# EAGLE design Pulsar Buddy (EAGLE 9.5.2)
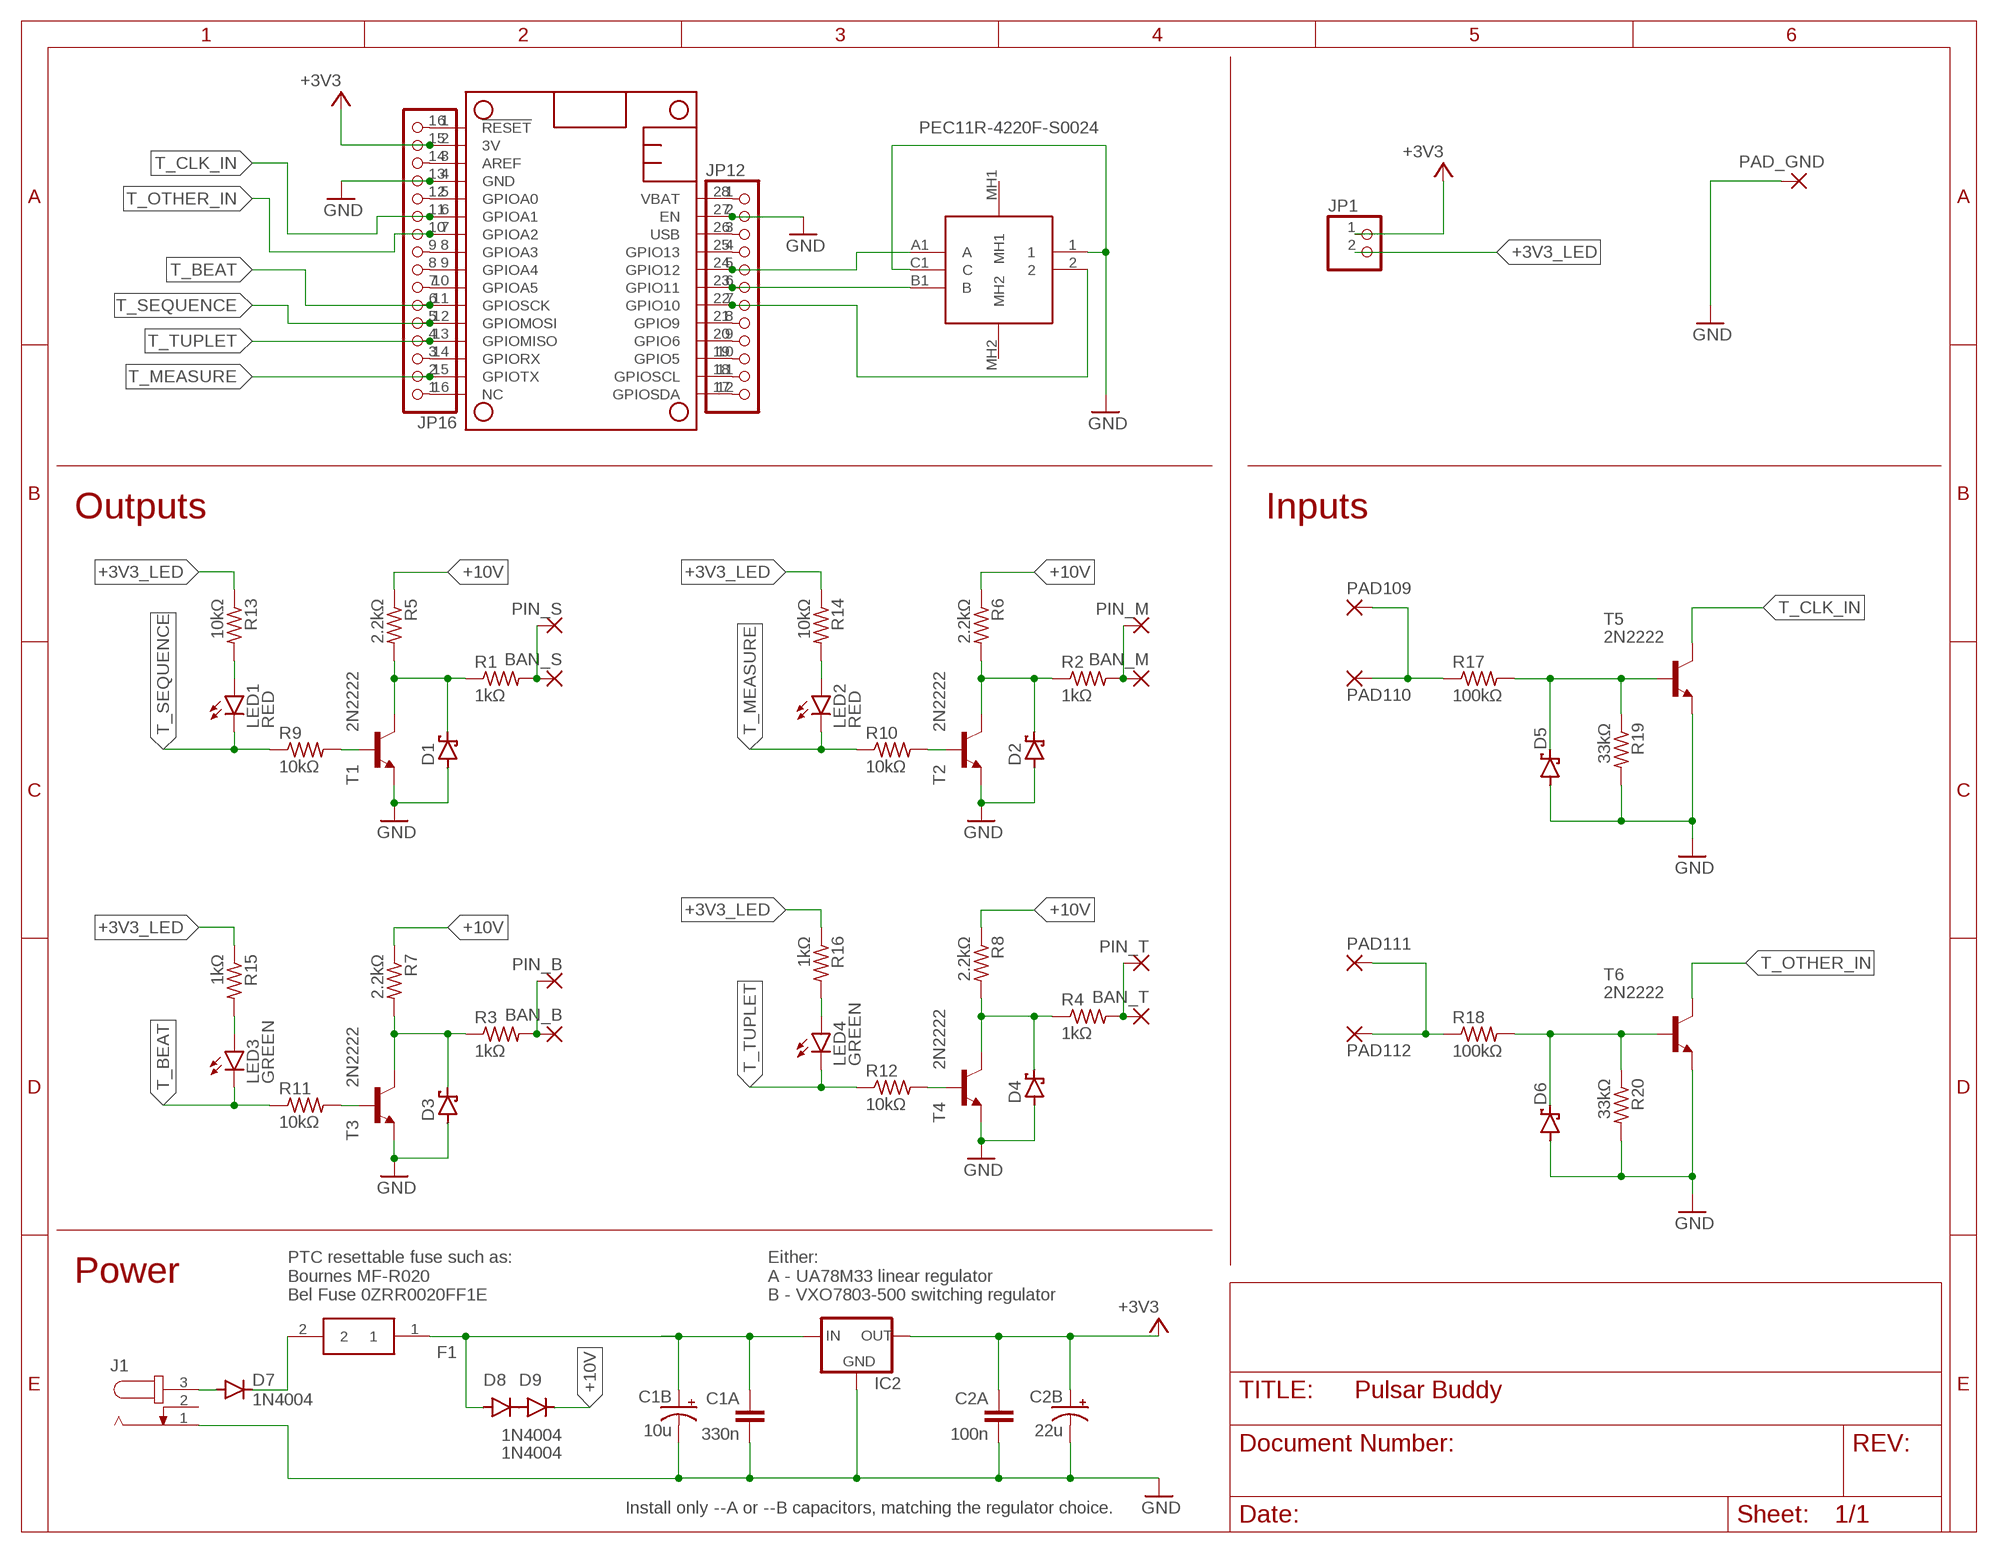
[diagram p0: schematic, sheet 1]

## Parts
BAN_B  WIREPADBANANA  [BANANA]
BAN_M  WIREPADBANANA  [BANANA]
BAN_S  WIREPADBANANA  [BANANA]
BAN_T  WIREPADBANANA  [BANANA]
C1A  330n  C-EU025-024X044  [C025-024X044]
C1B  10u  CPOL-USE5-5  [E5-5]
C2A  100n  C-EU025-024X044  [C025-024X044]
C2B  22u  CPOL-USE5-5  [E5-5]
D1  SCHOTTKY-DIODEDO35-7  [DO35-7]
D2  SCHOTTKY-DIODEDO35-7  [DO35-7]
D3  SCHOTTKY-DIODEDO35-7  [DO35-7]
D4  SCHOTTKY-DIODEDO35-7  [DO35-7]
D5  SCHOTTKY-DIODEDO35-7  [DO35-7]
D6  SCHOTTKY-DIODEDO35-7  [DO35-7]
D7  1N4004  [DO41-10]
D8  1N4004  [DO41-10]
D9  1N4004  [DO41-10]
F1  0ZRR0025FF1E  [0ZRR0025FF1E]
IC2  UA78M33CKCSTO-220  [TO220H]
J1  JACK-PLUG0  [SPC4077]
JP1  PINHD-1X2  [1X02]
JP12  HEADER-1X12  [1X12_ROUND]
JP16  HEADER-1X16ROUND  [1X16_ROUND]
LED1  RED  LED5MM  [LED5MM]
LED2  RED  LED5MM  [LED5MM]
LED3  GREEN  LED5MM  [LED5MM]
LED4  GREEN  LED5MM  [LED5MM]
MS101  FEATHERWING_NODIM  [FEATHERWING_DIM]
PAD109  WIREPAD  [M3]
PAD110  WIREPADBANANA  [BANANA]
PAD111  WIREPAD  [M3]
PAD112  WIREPADBANANA  [BANANA]
PAD_GND  WIREPADBANANA-GND  [BANANA-GND]
PIN_B  WIREPAD  [M3]
PIN_M  WIREPAD  [M3]
PIN_S  WIREPAD  [M3]
PIN_T  WIREPAD  [M3]
R1  1kΩ  R-US_0204/7  [0204/7]
R2  1kΩ  R-US_0204/7  [0204/7]
R3  1kΩ  R-US_0204/7  [0204/7]
R4  1kΩ  R-US_0204/7  [0204/7]
R5  2.2kΩ  R-US_0204/7  [0204/7]
R6  2.2kΩ  R-US_0204/7  [0204/7]
R7  2.2kΩ  R-US_0204/7  [0204/7]
R8  2.2kΩ  R-US_0204/7  [0204/7]
R9  10kΩ  R-US_0204/7  [0204/7]
R10  10kΩ  R-US_0204/7  [0204/7]
R11  10kΩ  R-US_0204/7  [0204/7]
R12  10kΩ  R-US_0204/7  [0204/7]
R13  10kΩ  R-US_0204/7  [0204/7]
R14  10kΩ  R-US_0204/7  [0204/7]
R15  1kΩ  R-US_0204/7  [0204/7]
R16  1kΩ  R-US_0204/7  [0204/7]
R17  100kΩ  R-US_0204/7  [0204/7]
R18  100kΩ  R-US_0204/7  [0204/7]
R19  33kΩ  R-US_0204/7  [0204/7]
R20  33kΩ  R-US_0204/7  [0204/7]
SW1  PEC11R-4220F-S0024  [PEC11R4220FS0024]
T1  2N2222  [TO92-EBC-OVAL]
T2  2N2222  [TO92-EBC-OVAL]
T3  2N2222  [TO92-EBC-OVAL]
T4  2N2222  [TO92-EBC-OVAL]
T5  2N2222  [TO92-EBC-OVAL]
T6  2N2222  [TO92-EBC-OVAL]

## Nets
+3V3: C2A.1 C2B.+ IC2.3(OUT) JP1.1 JP16.15 MS101.2(3V)
+3V3_LED: JP1.2 R13.1 R14.1 R15.1 R16.1
+5V_CPU: JP12.3 MS101.26(USB)
+10V: D9.C R5.1 R6.1 R7.1 R8.1
+12V: C1A.1 C1B.+ D8.A F1.1 IC2.1(IN)
GND: C1A.2 C1B.- C2A.2 C2B.- D1.A D2.A D3.A D4.A D5.A D6.A IC2.2(GND) J1.1 JP12.2 JP16.13 MS101.4(GND) MS101.27(EN) PAD_GND.C(P) R19.2 R20.2 SW1.1 SW1.C1(C) T1.E T2.E T3.E T4.E T5.E T6.E
N$1: JP12.5 MS101.24(GPIO12) SW1.A1(A)
N$2: JP12.7 MS101.22(GPIO10) SW1.2
N$3: JP12.6 MS101.23(GPIO11) SW1.B1(B)
N$4: D7.C F1.2
N$5: D7.A J1.3
N$6: LED1.A R13.2
N$7: LED2.A R14.2
N$8: R9.2 T1.B
N$9: D1.C R1.1 R5.2 T1.C
N$10: R10.2 T2.B
N$11: D2.C R2.1 R6.2 T2.C
N$12: LED3.A R15.2
N$13: R11.2 T3.B
N$14: D3.C R3.1 R7.2 T3.C
N$15: LED4.A R16.2
N$16: R12.2 T4.B
N$17: D4.C R4.1 R8.2 T4.C
N$18: D5.C R17.2 R19.1 T5.B
N$19: PAD111.1(P) PAD112.C(P) R18.1
N$20: PAD109.1(P) PAD110.C(P) R17.1
N$21: D6.C R18.2 R20.1 T6.B
N$22: JP16.16 MS101.1(!RESET)
N$23: JP16.14 MS101.3(AREF)
N$24: JP16.12 MS101.5(GPIOA0)
N$25: JP16.9 MS101.8(GPIOA3)
N$26: JP16.8 MS101.9(GPIOA4)
N$27: JP16.7 MS101.10(GPIOA5)
N$28: JP16.3 MS101.14(GPIORX)
N$29: JP16.1 MS101.16(NC)
N$30: JP12.12 MS101.17(GPIOSDA)
N$31: JP12.11 MS101.18(GPIOSCL)
N$32: JP12.10 MS101.19(GPIO5)
N$33: JP12.8 MS101.21(GPIO9)
N$34: JP12.9 MS101.20(GPIO6)
N$35: JP12.4 MS101.25(GPIO13)
N$36: D8.C D9.A
N$37: BAN_S.C(P) PIN_S.1(P) R1.2
N$38: BAN_M.C(P) PIN_M.1(P) R2.2
N$39: BAN_T.C(P) PIN_T.1(P) R4.2
N$40: BAN_B.C(P) PIN_B.1(P) R3.2
T_BEAT: JP16.6 LED3.K(C) MS101.11(GPIOSCK) R11.1
T_CLK_IN: JP16.11 MS101.6(GPIOA1) T5.C
T_MEASURE: JP16.2 LED2.K(C) MS101.15(GPIOTX) R10.1
T_OTHER_IN: JP16.10 MS101.7(GPIOA2) T6.C
T_SEQUENCE: JP16.5 LED1.K(C) MS101.12(GPIOMOSI) R9.1
T_TUPLET: JP16.4 LED4.K(C) MS101.13(GPIOMISO) R12.1
VBAT: JP12.1 MS101.28(VBAT)
Unconnected: J1.2 SW1.MH1 SW1.MH2

## Notes on the sheet
- Outputs | Inputs
- Power
- PTC resettable fuse such as:
  Bournes MF-R020
  Bel Fuse 0ZRR0020FF1E
- Either:
  A - UA78M33 linear regulator
  B - VXO7803-500 switching regulator
- Install only --A or --B capacitors, matching the regulator choice.

## Library data of the parts
BAN_B BAN_M BAN_S BAN_T PAD109-PAD112 PAD_GND PIN_B PIN_M PIN_S PIN_T = bits:WIREPAD: Wire PAD connect wire on PCB
C1A C2A = rcl:C-EU: CAPACITOR, European symbol; SPICEPREFIX: C
C1B C2B = rcl:CPOL-US: POLARIZED CAPACITOR, American symbol; SPICEPREFIX: C
D1-D6 = diode:SCHOTTKY-DIODE: Schottky Diode
D7-D9 = diode:1N4004: DIODE general purpose rectifier, 1 A
F1 = SamacSys:0ZRR0025FF1E: Resettable Fuses - PPTC Resettable Fuse 900mA Source: Datasheet <https://belfuse.com/resources/datasheets/circuitprotection/ds-cp-0zrr-series.pdf>; DESCRIPTION: Resettable Fuses - PPTC Resettable Fuse 900mA; HEIGHT: 12.7mm; MANUFACTURER_NAME: Bel-Stewart; MANUFACTURER_PART_NUMBER: 0ZRR0025FF1E; MOUSER_PART_NUMBER: 530-0ZRR0025FF1E; MOUSER_PRICE-STOCK: https://www.mouser.com/Search/Refine.aspx?Keyword=530-0ZRR0025FF1E
IC2 = pb extras:UA78M33CKCS: Reg Standard Lin Fix Pos 3.3V 0.5A 3-Pin Source: Datasheet <http://docs-emea.rs-online.com/webdocs/0c9c/0900766b80c9c904.pdf>
J1 = con-jack:JACK-PLUG: DC POWER JACK Power Jack, DC, Right Angle, Through Hole, Rated 5A at 16VDC, PC Terminals Distributor: Farnell (www.Farnell.de) Drawing: 84N1161.pdf / 84N1162.pdf Manufacturer: SPC Technology (www.spctechnology.com) Type: SPC4077 / SPC 4078; OC_FARNELL: unknown; OC_NEWARK: unknown
JP1 = pinhead:PINHD-1X2: PIN HEADER
JP12 = microbuilder:HEADER-1X12
JP16 = microbuilder:HEADER-1X16: PIN HEADER
LED1-LED4 = led:LED: LED OSRAM: - CHIPLED LG R971, LG N971, LY N971, LG Q971, LY Q971, LO R971, LY R971 LH N974, LH R974 LS Q976, LO Q976, LY Q976 LO Q996 - Hyper CHIPLED LW Q18S LB Q993, LB Q99A, LB R99A - SideLED LS A670, LO A670, LY A670, LG A670, LP A670 LB A673, LV A673, LT A673, LW A673 LH A674 LY A675 LS A676, LA A676, LO A676, LY A676, LW A676 LS A679, LY A679, LG A679 - Hyper Micro SIDELED® LS Y876, LA Y876, LO Y876, LY Y876 LT Y87S - SmartLED LW L88C, LW L88S LB L89C, LB L89S, LG L890 LS L89K, LO L89K, LY L89K LS L896, LA L896, LO L896, LY L896 - TOPLED LS T670, LO T670, LY T670, LG T670, LP T670 LSG T670, LSP T670, LSY T670, LOP T670, LYG T670 LG T671, LOG T671, LSG T671 LB T673, LV T673, LT T673, LW T673 LH T674 LS T676, LA T676, LO T676, LY T676, LB T676, LH T676, LSB T676, LW T676 LB T67C, LV T67C, LT T67C, LS T67K, LO T67K, LY T67K, LW E67C LS E67B, LA E67B, LO E67B, LY E67B, LB E67C, LV E67C, LT E67C LW T67C LS T679, LY T679, LG T679 LS T770, LO T770, LY T770, LG T770, LP T770 LB T773, LV T773, LT T773, LW T773 LH T774 LS E675, LA E675, LY E675, LS T675 LS T776, LA T776, LO T776, LY T776, LB T776 LHGB T686 LT T68C, LB T68C - Hyper Mini TOPLED® LB M676 - Mini TOPLED Santana® LG M470 LS M47K, LO M47K, LY M47K Source: http://www.osram.convergy.de LUXEON: - LUMILED® LXK2-PW12-R00, LXK2-PW12-S00, LXK2-PW14-U00, LXK2-PW14-V00 LXK2-PM12-R00, LXK2-PM12-S00, LXK2-PM14-U00 LXK2-PE12-Q00, LXK2-PE12-R00, LXK2-PE12-S00, LXK2-PE14-T00, LXK2-PE14-U00 LXK2-PB12-K00, LXK2-PB12-L00, LXK2-PB12-M00, LXK2-PB14-N00, LXK2-PB14-P00, LXK2-PB14-Q00 LXK2-PR12-L00, LXK2-PR12-M00, LXK2-PR14-Q00, LXK2-PR14-R00 LXK2-PD12-Q00, LXK2-PD12-R00, LXK2-PD12-S00 LXK2-PH12-R00, LXK2-PH12-S00 LXK2-PL12-P00, LXK2-PL12-Q00, LXK2-PL12-R00 Source: www.luxeon.com KINGBRIGHT: KA-3528ASYC Source: www.kingbright.com
MS101 = adafruit:FEATHERWING
R1-R20 = rcl:R-US_: RESISTOR, American symbol; SPICEPREFIX: R
SW1 = SamacSys:PEC11R-4220F-S0024: Bourns 24 Pulse Incremental Mechanical Rotary Encoder with a 6 mm Flat Shaft (Not Indexed), Through Hole Source: Datasheet <https://www.bourns.com/docs/Product-Datasheets/PEC11R.pdf>; ALLIED_NUMBER: 70276555; ALLIED_PRICE-STOCK: https://www.alliedelec.com/bourns-pec11r-4220f-s0024/70276555/; DESCRIPTION: Bourns 24 Pulse Incremental Mechanical Rotary Encoder with a 6 mm Flat Shaft (Not Indexed), Through Hole; HEIGHT: 27.5mm; MANUFACTURER_NAME: Bourns; MANUFACTURER_PART_NUMBER: PEC11R-4220F-S0024; MOUSER_PART_NUMBER: 652-PEC11R-4220F-S24; MOUSER_PRICE-STOCK: https://www.mouser.com/Search/Refine.aspx?Keyword=652-PEC11R-4220F-S24; RS_PART_NUMBER: 7377767P; RS_PRICE-STOCK: http://uk.rs-online.com/web/p/products/7377767P
T1-T6 = adafruit:2N2222: NPN TRANSISTOR Big oval pads

## Board
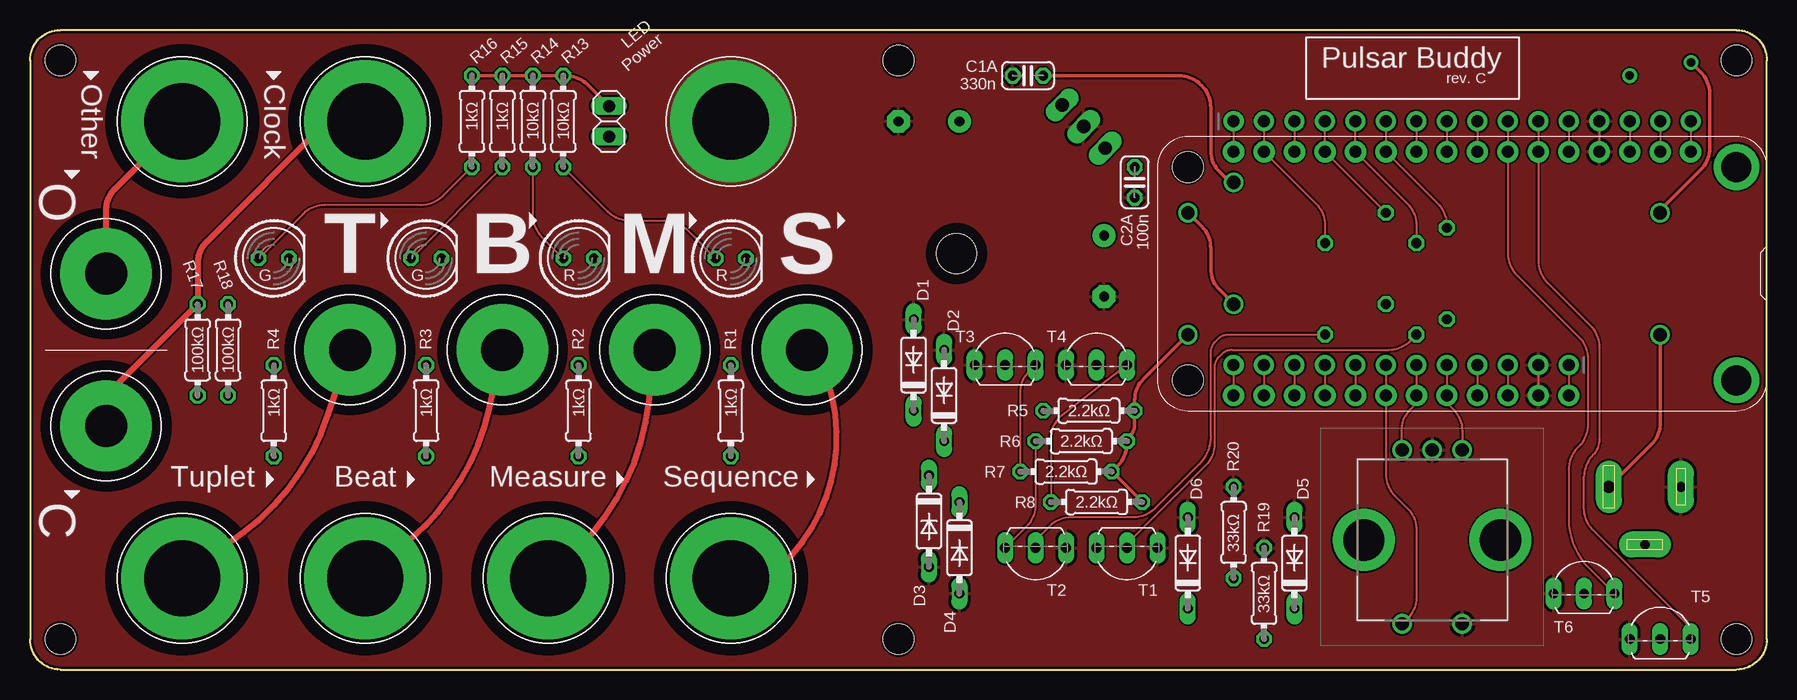
[diagram p1: board, top side]
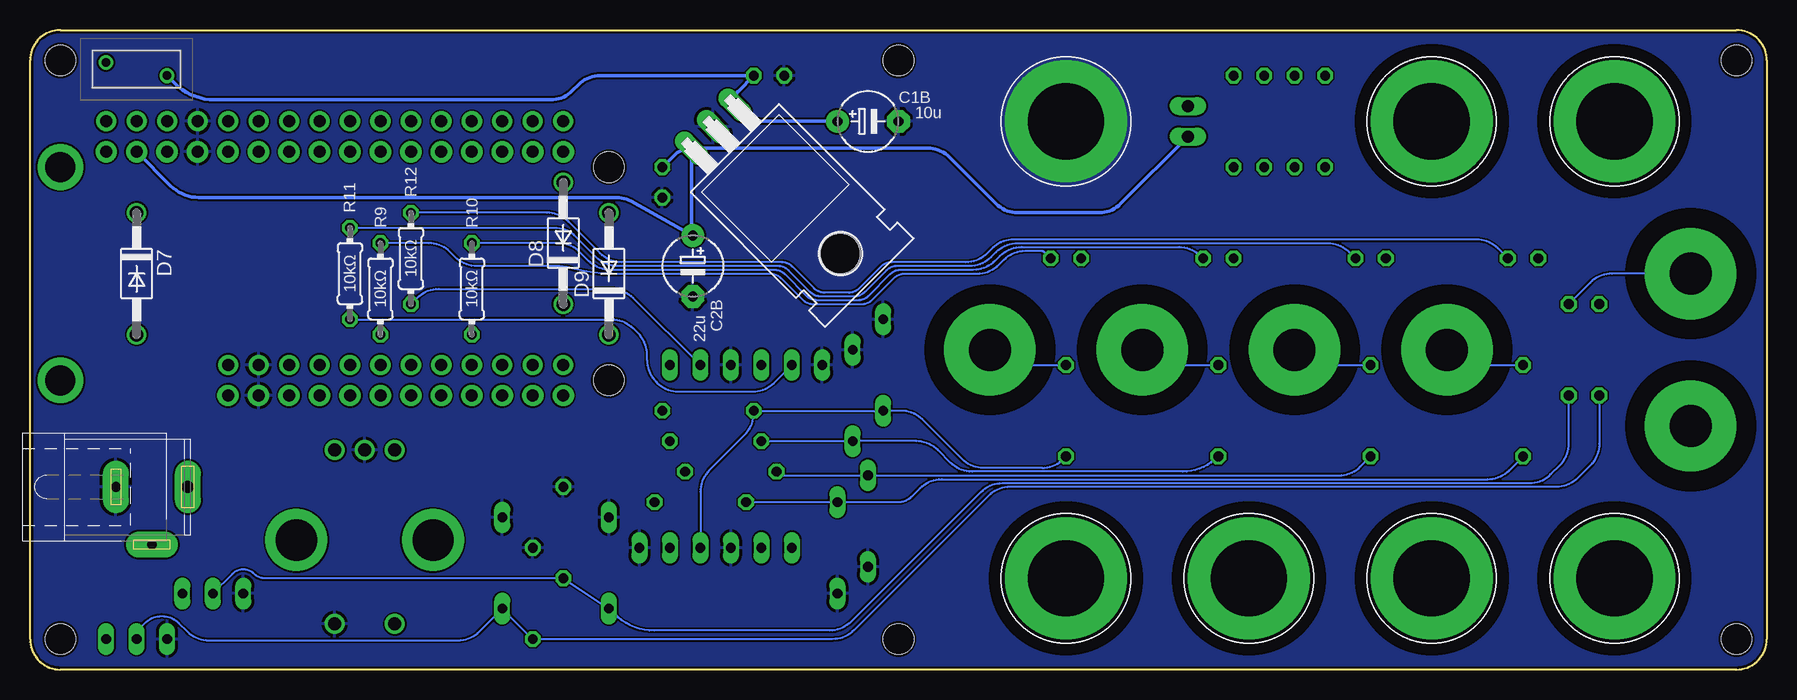
[diagram p2: board, bottom side, seen from below]

Size 144.78 x 53.34 mm. Coordinates in mm from the lower left corner, seen from the top.
Outline: 2.54,0 142.24,0 arc90 144.78,2.54 144.78,50.8 arc90 142.24,53.34 2.54,53.34 arc90 0,50.8 0,2.54 arc90 2.54,0
Copper layers (1*16): Top 0.035mm / dielectric 1.5mm / Bottom 0.035mm
Design rules "aisler_2_layer *": minimum track width 6mil, minimum drill 0.3mm, track to track 6mil, track to pad 6mil, pad to pad 6mil, via to via 6mil, smd to smd 0.1mm, copper to edge 0.2mm, drill to drill 0.21mm, minimum pad ring 0.25mm, minimum via ring 0.15mm, stop-mask expansion 0mil, vias tented up to drill 0mil, thermal gap 10mil
Holes 2.54 mm at 2.54,50.8 142.24,50.8 142.24,2.54 2.54,2.54 72.39,2.54 72.39,50.8

### Footprints (pad centres in the part's own frame; a part is rotated, then mirrored left to right if it is on the bottom)
BANANA = drill 6.35 pad 10.16: C 0,0
C025-024X044 = drill 0.813 octagon: 1 -1.27,0; 2 1.27,0
E5-5 = drill 0.813 pad 1.905: + -2.54,0 | drill 0.813 pad 1.905 octagon: - 2.54,0
DO35-7 = drill 0.813 long: A 3.81,0; C -3.81,0
DO41-10 = drill 1.118: A 5.08,0; C -5.08,0
0ZRR0025FF1E = drill 0.71 pad 1.217: 1 0,0; 2 5.1,-1.1
TO220H = drill 1.118 long: 1 -2.54,-10.16; 2 0,-10.16; 3 2.54,-10.16 | hole 3.302: 0,4.826
SPC4077 = drill 0.8 pad 2.184 long: 1 -3,0; 2 0,-4.8 | drill 1 pad 2.184 long: 3 3,0
1X02 = drill 1.016 long: 1 -1.27,0; 2 1.27,0
1X12_ROUND = drill 1 pad 1.676: 1 -13.97,0; 2 -11.43,0; 3 -8.89,0; 4 -6.35,0; 5 -3.81,0; 6 -1.27,0; 7 1.27,0; 8 3.81,0; 9 6.35,0; 10 8.89,0; 11 11.43,0; 12 13.97,0
1X16_ROUND = drill 1 pad 1.676: 1 -19.05,0; 2 -16.51,0; 3 -13.97,0; 4 -11.43,0; 5 -8.89,0; 6 -6.35,0; 7 -3.81,0; 8 -1.27,0; 9 1.27,0; 10 3.81,0; 11 6.35,0; 12 8.89,0; 13 11.43,0; 14 13.97,0; 15 16.51,0; 16 19.05,0
LED5MM = drill 0.813 octagon: A -1.27,0; K 1.27,0
FEATHERWING_DIM = drill 1 pad 1.778: 1 6.35,1.27; 2 8.89,1.27; 3 11.43,1.27; 4 13.97,1.27; 5 16.51,1.27; 6 19.05,1.27; 7 21.59,1.27; 8 24.13,1.27; 9 26.67,1.27; 10 29.21,1.27; 11 31.75,1.27; 12 34.29,1.27; 13 36.83,1.27; 14 39.37,1.27; 15 41.91,1.27; 16 44.45,1.27; 17 44.45,21.59; 18 41.91,21.59; 19 39.37,21.59; 20 36.83,21.59; 21 34.29,21.59; 22 31.75,21.59; 23 29.21,21.59; 24 26.67,21.59; 25 24.13,21.59; 26 21.59,21.59; 27 19.05,21.59; 28 16.51,21.59 | drill 2.5 pad 3.81: P$1 2.54,20.32; P$2 2.54,2.54 | hole 2.54: 48.26,20.32; 48.26,2.54
M3 = drill 3.5 pad 7.62: 1 0,0
BANANA-GND = drill 6.35 pad 10.16: C 0,0
0204/7 = drill 0.813 octagon: 1 -3.81,0; 2 3.81,0
PEC11R4220FS0024 = drill 1.1 pad 1.65: 1 0,0; 2 5,0; A1 0,-14.5; B1 5,-14.5; C1 2.5,-14.5 | drill 3.441 pad 5.161: MH1 -3.2,-7; MH2 8.2,-7
TO92-EBC-OVAL = drill 0.813 long: B 0,-1.27; C 2.54,-1.27; E -2.54,-1.27

### Placement (x,y rotation side)
BAN_B  27.94,7.62 0 top
BAN_M  43.18,7.62 0 top
BAN_S  58.42,7.62 0 top
BAN_T  12.7,7.62 0 top
C1A  83.19,49.53 180 top
C1B  74.93,45.72 0 bottom
C2A  92.08,40.64 270 top
C2B  89.53,33.66 270 bottom
D1  73.66,25.4 90 top
D2  76.2,22.86 90 top
D3  74.93,12.38 270 top
D4  77.47,10.16 270 top
D5  105.41,8.89 90 top
D6  96.52,8.89 90 top
D7  135.89,33.02 270 bottom
D8  100.33,35.56 90 bottom
D9  96.52,33.02 90 bottom
F1  133.35,49.53 180 bottom
IC2  80.64,38.1 225 bottom
J1  134.62,15.24 0 bottom
JP1  48.26,45.72 90 top
JP12  114.3,25.4 180 top
JP16  119.38,45.72 0 top
LED1  58.42,34.29 0 top
LED2  45.72,34.29 0 top
LED3  33.02,34.29 0 top
LED4  20.32,34.29 0 top
MS101  144.78,44.45 180 top
PAD109  6.35,20.32 0 top
PAD110  27.94,45.72 0 top
PAD111  6.35,33.02 0 top
PAD112  12.7,45.72 0 top
PAD_GND  58.42,45.72 0 top
PIN_B  39.37,26.67 0 top
PIN_M  52.07,26.67 0 top
PIN_S  64.77,26.67 0 top
PIN_T  26.67,26.67 0 top
R1  58.42,21.59 90 top
R2  45.72,21.59 90 top
R3  33.02,21.59 90 top
R4  20.32,21.59 90 top
R5  88.27,21.59 180 top
R6  87.63,19.05 180 top
R7  86.36,16.51 180 top
R8  88.9,13.97 180 top
R9  115.57,31.75 270 bottom
R10  107.95,31.75 270 bottom
R11  118.11,33.02 270 bottom
R12  113.03,34.29 270 bottom
R13  44.45,45.72 270 top
R14  41.91,45.72 270 top
R15  39.37,45.72 270 top
R16  36.83,45.72 270 top
R17  13.97,26.67 270 top
R18  16.51,26.67 270 top
R19  102.87,6.35 90 top
R20  100.33,11.43 90 top
SW1  119.38,3.81 180 top
T1  91.44,8.89 180 top
T2  83.82,8.89 180 top
T3  81.28,26.67 0 top
T4  88.9,26.67 0 top
T5  135.89,3.81 0 top
T6  129.54,7.62 0 top

### Tracks (layer width: path | path; a pad name or v marks a point on that pad's centre or on a via)
+3V3
  Top 0.152: JP16.15 MS101.2
  Bottom 0.305: MS101.2 133.05,40.34 arc-45 130.71,39.37 95.91,39.37 arc29 94.67,39.05 C2B.+ 89.62,36.1 IC2.3 | JP1.1 53.87,38.84 arc45 55.66,38.1 62.45,38.1 arc45 64.24,38.84 68.14,42.74 arc-45 69.94,43.49 IC2.3 | C2A.1 91.11,42.87 arc45 IC2.3
+3V3_LED
  Top 0.305: R16.1 R15.1 R14.1 R13.1 44.67,49.53 arc-45 46.46,48.79 JP1.2
+5V_CPU
  Top 0.152: JP12.3 MS101.26
+10V
  Top 0.305: D9.C 92.82,24.24 arc45 92.08,22.44 R5.1 92.08,20.58 arc-45 R6.1 91.44,18.83 arc-45 90.7,17.04 R7.1 R8.1
+12V
  Top 0.305: C1A.1 95.78,49.53 arc-45 97.58,48.79 97.68,48.69 arc-45 98.42,46.89 98.42,43.28 arc45 99.17,41.48 100.01,40.64 D8.A
  Bottom 0.305: F1.1 132.72,48.9 arc-45 129.39,47.52 101.38,47.52 arc-45 99.59,48.26 99.06,48.79 arc45 97.26,49.53 C1A.1 85.74,48.25 arc-45 86.03,47.53 IC2.1 85.42,46.46 arc-45 83.62,45.72 C1B.+
GND
  Top 0.152: JP16.13 MS101.4 | JP12.2 MS101.27
  pour Top: -1.27,54.61 -1.27,-1.27 146.05,-1.27 146.05,54.61
  pour Bottom: -1.27,54.61 -1.27,-1.27 146.05,-1.27 146.05,54.61
N$1
  Top 0.152: SW1.A1 119.38,19.9 arc45 118.64,21.7 118.11,22.23 MS101.24 JP12.5
N$2
  Top 0.152: SW1.2 114.83,4.26 arc45 115.57,6.05 115.57,11.65 arc45 114.83,13.44 113.77,14.5 arc-45 113.03,16.29 MS101.22 JP12.7
N$3
  Top 0.152: SW1.B1 114.3,18.39 114.3,19.9 arc-45 115.04,21.7 115.57,22.23 MS101.23 JP12.6
N$4
  Top 0.305: D7.C 135.89,38.32 139.27,41.7 arc45 140.02,43.5 140.02,48.01 arc45 139.27,49.81 F1.2
N$5
  Top 0.305: J1.3 135.15,18.77 arc45 135.89,20.56 D7.A
N$6
  Top 0.152: R13.2 48.15,38.21 arc45 49.95,37.47 52.92,37.47 arc-45 54.72,36.72 LED1.A
N$7
  Top 0.152: R14.2 41.91,37.88 arc45 42.65,36.09 LED2.A
N$8
  Top 0.152: R9.2 115.04,27.41 arc-45 113.25,26.67 100.22,26.67 arc45 99.32,26.3 99.11,26.09 arc45 98.74,25.19 98.74,18.83 arc-45 98,17.04 91.44,10.48 T1.B
N$9
  Bottom 0.152: T1.C 88.9,14.82 arc45 88.16,16.62 85.2,19.58 arc-45 84.45,21.37 R5.2 D1.C 72.17,21.59 arc45 70.38,20.85 67.1,17.57 arc-45 65.31,16.83 60.42,16.83 arc-45 58.63,17.57 R1.1
N$10
  Top 0.152: R10.2 99.9,27.94 arc45 99.01,27.57 98.8,27.36 arc45 98.42,26.46 98.42,19.47 arc-45 97.46,17.13 93.77,13.44 arc-45 91.97,12.7 86.78,12.7 arc45 84.98,11.96 83.82,10.79 T2.B
N$11
  Top 0.152: R6.2 83.82,13.75 arc-45 83.08,11.96 T2.C
  Bottom 0.152: R6.2 D2.C 70.9,19.05 arc45 69.11,18.31 68.05,17.25 arc-45 66.26,16.51 48.71,16.51 arc-45 45.77,17.73 R2.1
N$12
  Top 0.152: R15.2 LED3.A
N$13
  Bottom 0.152: R11.2 96.3,29.21 arc45 94.51,28.47 94.09,28.05 arc45 93.34,26.25 93.34,25.82 arc-45 92.6,24.02 92.5,23.92 arc-45 90.7,23.18 84.56,23.18 arc-45 82.76,23.92 T3.B
N$14
  Top 0.152: R7.2 82.55,23.08 arc-45 83.29,24.87 T3.C
  Bottom 0.152: R7.2 82.23,16.19 D3.C 35.66,16.19 arc-45 33.86,16.94 R3.1
N$15
  Top 0.152: R16.2 34.4,39.48 arc-45 32.6,38.73 24.55,38.73 arc45 22.75,37.99 LED4.A
N$16
  Bottom 0.152: R12.2 112.5,31.01 arc45 110.71,31.75 96.3,31.75 arc45 94.51,31.01 T4.B
N$17
  Top 0.152: T4.C 85.83,21.06 arc45 85.09,19.27 R8.2
  Bottom 0.152: R4.1 21.48,16.62 arc45 23.28,15.88 68.8,15.88 arc-45 70.59,15.13 71.31,14.42 arc45 72.39,13.97 D4.C R8.2
N$18
  Bottom 0.152: R17.2 13.97,18.83 arc45 14.71,17.04 15.77,15.98 arc45 17.56,15.24 63.08,15.24 arc-45 64.88,14.5 76.09,3.28 arc45 77.89,2.54 R19.1 D5.C 107.31,3.18 arc45 109.1,2.44 129.88,2.44 arc45 131.67,3.18 132.37,3.88 arc-45 133.79,4.47 arc-45 135.21,3.88 135.89,3.2 T5.B
N$19
  Top 0.508: PAD111.1 6.35,38.32 arc-45 7.09,40.11 PAD112.C
  Bottom 0.152: PAD111.1 12.92,33.02 arc-45 14.71,32.28 R18.1
N$20
  Top 0.508: PAD110.C 24.77,45.72 14.71,35.67 arc45 13.97,33.87 R17.1 7.09,23.6 arc45 6.35,21.81 PAD109.1
N$21
  Bottom 0.152: R18.2 16.51,18.83 arc45 17.25,17.04 17.99,16.3 arc45 19.79,15.56 63.72,15.56 arc-45 65.51,14.81 76.32,4 arc45 78.12,3.26 92.75,3.26 arc45 96.08,4.64 D6.C 98.86,6.64 R20.1 125.22,7.62 arc45 126.11,7.99 arc-90 127.9,7.99 T6.B
N$22
  Top 0.152: JP16.16 MS101.1
N$23
  Top 0.152: JP16.14 MS101.3
N$24
  Top 0.152: JP16.12 MS101.5
N$25
  Top 0.152: JP16.9 MS101.8
N$26
  Top 0.152: JP16.8 MS101.9
N$27
  Top 0.152: JP16.7 MS101.10
N$28
  Top 0.152: JP16.3 MS101.14
N$29
  Top 0.152: JP16.1 MS101.16
N$30
  Top 0.152: JP12.12 MS101.17
N$31
  Top 0.152: JP12.11 MS101.18
N$32
  Top 0.152: JP12.10 MS101.19
N$33
  Top 0.152: JP12.8 MS101.21
N$34
  Top 0.152: JP12.9 MS101.20
N$35
  Top 0.152: JP12.4 MS101.25
N$36
  Top 0.305: D8.C 99.17,31.64 arc-45 98.42,33.44 98.42,35.14 arc45 97.68,36.94 D9.A
N$37
  Top 0.508: BAN_S.C 61.38,7.62 arc72 66.5,24.01 66.04,25.4 PIN_S.1
  Bottom 0.152: PIN_S.1 64.24,26.14 arc-45 62.45,25.4 R1.2
N$38
  Top 0.508: BAN_M.C 45.76,10.2 arc39 51.59,22.32 PIN_M.1
  Bottom 0.152: PIN_M.1 51.54,26.14 arc-45 49.75,25.4 R2.2
N$39
  Top 0.508: BAN_T.C 17.78,11.43 arc35 24.87,21.26 PIN_T.1
  Bottom 0.152: PIN_T.1 26.14,26.14 arc-45 24.35,25.4 R4.2
N$40
  Top 0.508: BAN_B.C 31.69,10.83 arc37 38.3,21.85 PIN_B.1
  Bottom 0.152: PIN_B.1 38.84,26.14 arc-45 37.05,25.4 R3.2
T_BEAT
  Top 0.152: R11.1 118.11,37.05 arc45 117.37,38.84 MS101.11 JP16.6
  Bottom 0.152: LED3.K 34.82,34.82 arc-45 36.61,35.56 62.45,35.56 arc-45 64.24,34.82 64.66,34.4 arc45 66.46,33.66 72.5,33.66 arc-45 73.4,33.28 75.19,31.49 arc45 76.09,31.11 78.85,31.11 arc45 79.75,31.49 81.54,33.28 arc-45 82.44,33.66 95.78,33.66 arc45 97.58,34.4 99.27,36.09 arc-45 101.06,36.83 R11.1
T_CLK_IN
  Top 0.152: JP16.11 MS101.6 125.73,34.07 arc45 126.47,32.28 130.07,28.68 arc-45 130.81,26.89 130.81,19.16 arc-45 130.28,17.89 arc45 129.54,16.09 129.54,13.44 arc45 130.28,11.64 138.43,3.49 T5.C
T_MEASURE
  Top 0.152: R10.1 107.95,37.05 arc45 107.21,38.84 MS101.15 JP16.2
  Bottom 0.152: LED2.K 47.2,34.5 arc-45 48.99,35.24 62.13,35.24 arc-45 63.93,34.5 64.34,34.08 arc45 66.14,33.34 72.18,33.34 arc-45 73.08,32.97 74.88,31.17 arc45 75.77,30.8 79.17,30.8 arc45 80.06,31.17 81.86,32.97 arc-45 82.76,33.34 96.42,33.34 arc45 98.22,34.08 98.95,34.82 arc-45 100.75,35.56 R10.1
T_OTHER_IN
  Top 0.152: T6.C 129.91,8.52 arc-45 128.27,12.48 128.27,16.73 arc-45 129.01,18.52 129.11,18.62 arc45 129.86,20.42 129.86,25.93 arc45 129.11,27.73 123.93,32.91 arc-45 123.19,34.71 MS101.7 JP16.10
T_SEQUENCE
  Top 0.152: R9.1 115.57,37.05 arc45 114.83,38.84 MS101.12 JP16.5
  Bottom 0.152: LED1.K 60.22,34.82 arc-45 60.48,34.92 61.81,34.92 arc-45 63.61,34.18 64.03,33.76 arc45 65.82,33.02 71.86,33.02 arc-45 72.76,32.65 74.56,30.85 arc45 75.46,30.48 79.48,30.48 arc45 80.38,30.85 82.18,32.65 arc-45 83.08,33.02 96.25,33.02 arc14 99.38,33.41 100.02,33.58 100.65,33.66 107.53,33.66 arc45 109.33,34.4 109.75,34.82 arc-45 111.54,35.56 R9.1
T_TUPLET
  Top 0.152: R12.1 MS101.13 JP16.4
  Bottom 0.152: R12.1 101.7,38.1 arc45 99.9,37.36 97.26,34.72 arc-45 95.47,33.97 82.12,33.97 arc45 81.23,33.6 79.43,31.8 arc-45 78.53,31.43 76.54,31.43 arc-45 75.64,31.8 73.85,33.6 arc45 72.95,33.97 66.78,33.97 arc-45 64.98,34.72 64.56,35.13 arc45 62.77,35.88 24.23,35.88 arc45 22.43,35.13 LED4.K
VBAT
  Top 0.152: JP12.1 MS101.28

### Text on the board
tPlace: LED / Power
tNames: ⏚ | Pulsar Buddy | rev. C | Other | Clock | O | T | B | M | S | G | G | R | R | Tuplet | Beat | Measure | Sequence | C